# Altium schematic sheet Microcontroller.SchDoc
size A
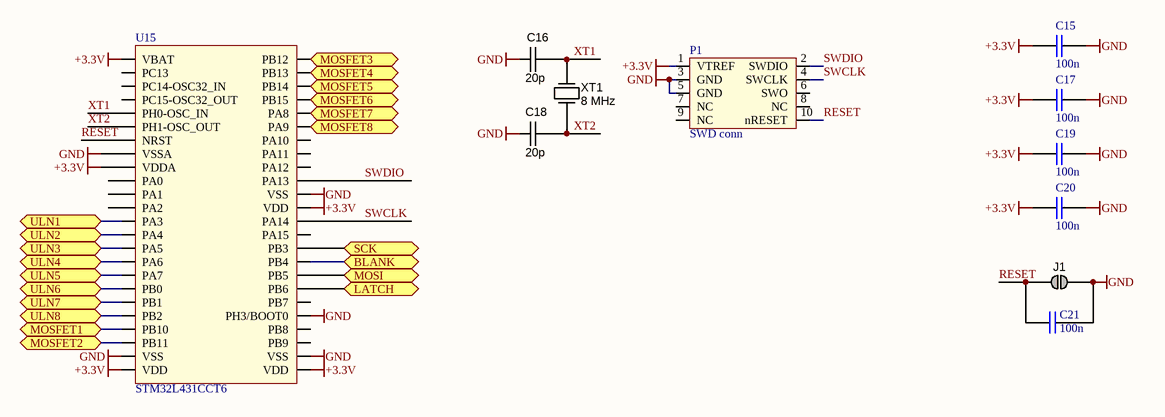
[diagram p0: Microcontroller.SchDoc]

## Parts
C15  100n  [Cap 0603]
C16  value 20p  [CAPC2012X135N]  (hidden comment: approved sub OK)
C17  100n  [Cap 0603]
C18  value 20p  [CAPC2012X135N]  (hidden comment: approved sub OK)
C19  100n  [Cap 0603]
C20  100n  [Cap 0603]
C21  100n  [Cap 0603]
J1  Jumper  [HDR1X2]  (value not drawn)  (no BOM)
P1  SWD conn  [SWD connector]
U15  STM32L431CCT6  [STM-LQFP48]
XT1  8 MHz  [CRYSTAL_HC49-US-SM]

## Ports
BLANK, LATCH, MOSFET1, MOSFET2, MOSFET3, MOSFET4, MOSFET5, MOSFET6, MOSFET7, MOSFET8, MOSI, SCK, ULN1, ULN2, ULN3, ULN4, ULN5, ULN6, ULN7, ULN8

## Nets
+3.3V: C15.1 C17.1 C19.1 C20.1 P1.1(VTREF) U15.1(VBAT) U15.9(VDDA) U15.24(VDD) U15.36(VDD) U15.48(VDD)
GND: C15.2 C16.2 C17.2 C18.2 C19.2 C20.2 C21.1 J1.2 P1.3(GND) P1.5(GND) U15.8(VSSA) U15.23(VSS) U15.35(VSS) U15.44(PH3/BOOT0) U15.47(VSS)
BLANK: U15.40(PB4) ; port BLANK
LATCH: U15.42(PB6) ; port LATCH
MOSFET1: U15.21(PB10) ; port MOSFET1
MOSFET2: U15.22(PB11) ; port MOSFET2
MOSFET3: U15.25(PB12) ; port MOSFET3
MOSFET4: U15.26(PB13) ; port MOSFET4
MOSFET5: U15.27(PB14) ; port MOSFET5
MOSFET6: U15.28(PB15) ; port MOSFET6
MOSFET7: U15.29(PA8) ; port MOSFET7
MOSFET8: U15.30(PA9) ; port MOSFET8
MOSI: U15.41(PB5) ; port MOSI
RESET: C21.2 J1.1 P1.10(nRESET) U15.7(NRST)
SCK: U15.39(PB3) ; port SCK
SWCLK: P1.4(SWCLK) U15.37(PA14)
SWDIO: P1.2(SWDIO) U15.34(PA13)
ULN1: U15.13(PA3) ; port ULN1
ULN2: U15.14(PA4) ; port ULN2
ULN3: U15.15(PA5) ; port ULN3
ULN4: U15.16(PA6) ; port ULN4
ULN5: U15.17(PA7) ; port ULN5
ULN6: U15.18(PB0) ; port ULN6
ULN7: U15.19(PB1) ; port ULN7
ULN8: U15.20(PB2) ; port ULN8
XT1: C16.1 U15.5(PH0-OSC_IN) XT1.2(OUT)
XT2: C18.1 U15.6(PH1-OSC_OUT) XT1.1(IN)

Not connected (* = marked no-connect by the designer): P1 6(SWO) 7(NC) 8(NC) 9(NC); U15 2(PC13) 3(PC14-OSC32_IN) 4(PC15-OSC32_OUT) 10(PA0) 11(PA1) 12(PA2) 31(PA10) 32(PA11) 33(PA12) 38(PA15) 43(PB7) 45(PB8) 46(PB9)

## Library data of the parts
C15 C17 C19-C21 = Cap 100nF 50V 0603 SMD: Capacitor 100nF 50V 0603 SMD
C16 C18 = CAPC_100n_0805_X7R_50V_10%: Capacitor SMD Cer 100nF 10% 50V X7R 0805; Manufacturer 1: Kemet; Manufacturer Part Number 1: C0805C104K5RACTU; Ratings: 50V; X7R; Material: ceramic; SCDType: undef; Package / Case: 0805 (2012 metric); Tolerance: ±10%; Supplier 1: Digi-Key; Supplier Part Number 1: 399-1170-1-ND
J1 = JUMP1: SMD jumper
P1 = SW_debug: SWD connector
U15 = STM32L431CCT6: STM32 L4; Mouser: 511-STM32L431CCT6
XT1 = Crystal_6MHz_HC49/US: Resonator Ceramic 6.00 MHz 30ppm; Manufacturer 1: CTS-Frequency Controls; Manufacturer Part Number 1: ATS060BSM-1; Frequency: 6MHz; Frequency Stability: ±50ppm; Load Capacitance: 18pF; Operating Mode: Fundamental; Parameter Name: 0.169" (4.30mm); SCDType: spec; Package / Case: HC49/US-SM; Ratings: 6.00 MHz; Supplier 1: Digi-Key; Supplier Part Number 1: CTX882CT-ND; Type: MHz Crystal; Frequency Tolerance: ±30ppm; Operating Temperature: -20°C ~ 70°C; Mounting Type: Surface Mount; Size / Dimension: 0.437" L x 0.190" W (11.10mm x 4.83mm); ComponentLink1URL: http://www.ctscorp.com/components/Datasheets/008-0309-0.pdf; ComponentLink1Description: http://www.ctscorp.com/components/Datasheets/008-0309-0.pdf